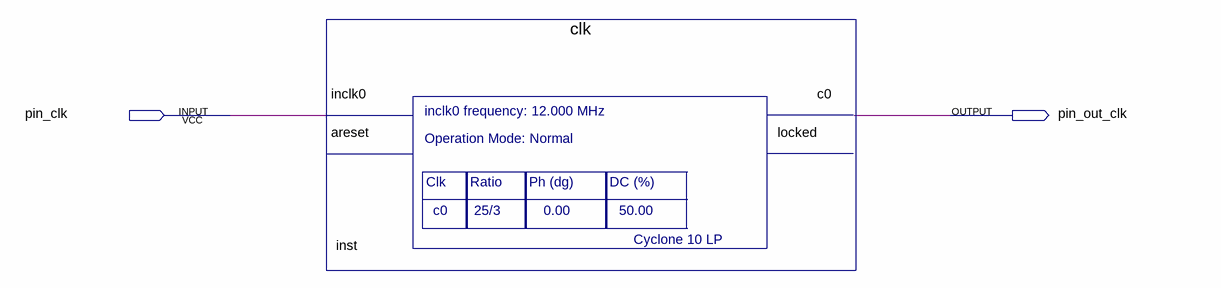
[diagram p0: schematic sheet]
// Quartus schematic Block3.bdf as structural Verilog: 1 symbols, 2 pins
module Block3 (
  input  pin_clk,
  output pin_out_clk
);

  clk inst (.inclk0(pin_clk), .c0(pin_out_clk));  // open: areset, locked
endmodule
